# EAGLE design mini-48SE-0.7 (EAGLE 6.3)
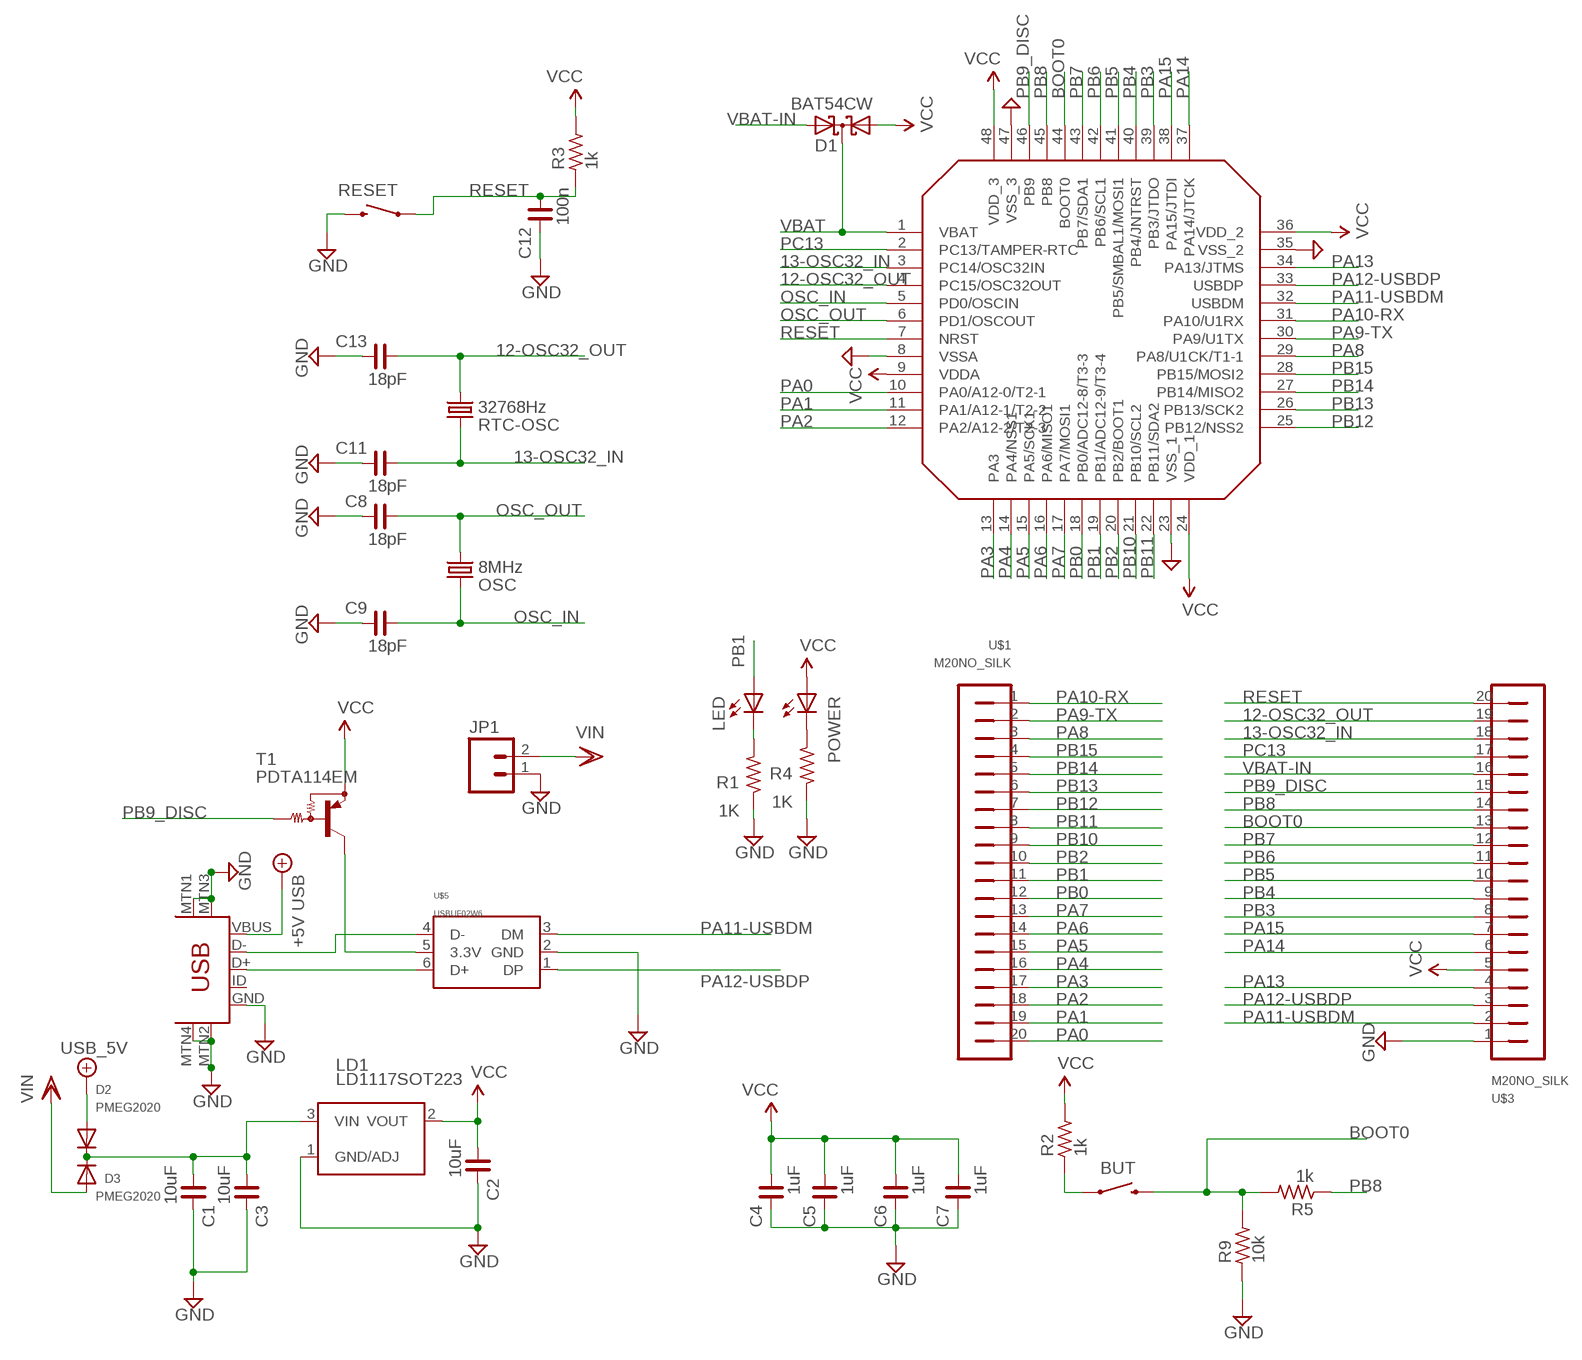
[diagram p0: schematic, sheet 1]

## Parts
BUT  SWITCH-MOMENTARY-2TS-1185  [TS1185]
C1  10uF  C_0603  [C0603]
C2  10uF  C_0805  [C0805]
C3  10uF  C_0603  [C0603]
C4  1uF  C_0603  [C0603]
C5  1uF  C_0603  [C0603]
C6  1uF  C_0603  [C0603]
C7  1uF  C_0603  [C0603]
C8  18pF  C_0603  [C0603]
C9  18pF  C_0603  [C0603]
C11  18pF  C_0603  [C0603]
C12  100n  C_0603  [C0603]
C13  18pF  C_0603  [C0603]
D1  BAT54CW  [SOT323R]
D2  PMEG2020  DIODESOD-323  [SOD-323]
D3  PMEG2020  DIODESOD-323  [SOD-323]
JP1  M02-JST-2MM-SMT  [JST-2-SMD]
LD1  LD1117SOT223  [SOT223]
LED  LED  LEDCHIPLED_1206  [CHIPLED_1206]
OSC  8MHz  CRYSTALTC26HM  [TC26H-M]
POWER  green  LEDCHIP-LED0603  [CHIP-LED0603]
R1  1K  R_0603  [R0603]
R2  1k  R_0603  [R0603]
R3  1k  R_0603  [R0603]
R4  1K  R_0603  [R0603]
R5  1k  R_0603  [R0603]
R9  10k  R_0603  [R0603]
RESET  SWITCH-MOMENTARY-2TS-1185  [TS1185]
RTC-OSC  32768Hz  CRYSTALTC26HM  [TC26H-M]
T1  PDTA114EM  PNP-DRIVERSOT323  [SOT323R]
U$1  M20NO_SILK  [1X20_NO_SILK]
U$3  M20NO_SILK  [1X20_NO_SILK]
U$4  STM32F103_48  [LQFP48-7X7]
U$5  USBUF02W6  [SC70-6]
USB  USB-MINIB-5PIN  [USB-MINIB]

## Nets
12-OSC32_OUT: C13.1 RTC-OSC.1 U$3.19 U$4.4(PC15/OSC32OUT)
13-OSC32_IN: C11.1 RTC-OSC.2 U$3.18 U$4.3(PC14/OSC32IN)
+5V/2 [vcc]: D2.A USB.VBUS ; supply symbol labelled USB_5V, +5V USB
BOOT0: BUT.2 R5.2 R9.2 U$3.13 U$4.44(BOOT0)
DGND: C1.2 C2.2 C3.2 C4.2 C5.2 C6.2 C7.2 C8.2 C9.2 C11.2 C12.2 C13.2 JP1.1 LD1.1(GND/ADJ) R1.1 R4.1 R9.1 RESET.2 U$3.1 U$4.8(VSSA) U$4.23(VSS_1) U$4.35(VSS_2) U$4.47(VSS_3) U$5.2(GND) USB.GND USB.MTN1(MTN2) USB.MTN2(MTN3) USB.MTN3(MTN1) USB.MTN4 ; supply symbol labelled GND
N$1: BUT.1 R2.1
N$2: LED.C R1.2
N$3: POWER.C R4.2
N$5 [vcc]: C1.1 C3.1 D2.C D3.C LD1.3(VIN)
N$6: T1.3(C) U$5.5(3.3V)
N$14: U$5.4(D-) USB.D-
N$17: U$5.6(D+) USB.D+
OSC_IN: C9.1 OSC.2 U$4.5(PD0/OSCIN)
OSC_OUT: C8.1 OSC.1 U$4.6(PD1/OSCOUT)
PA0: U$1.20 U$4.10(PA0/A12-0/T2-1)
PA1: U$1.19 U$4.11(PA1/A12-1/T2-2)
PA2: U$1.18 U$4.12(PA2/A12-2/T2-3)
PA3: U$1.17 U$4.13(PA3)
PA4: U$1.16 U$4.14(PA4/NSS1)
PA5: U$1.15 U$4.15(PA5/SCK1)
PA6: U$1.14 U$4.16(PA6/MISO1)
PA7: U$1.13 U$4.17(PA7/MOSI1)
PA8: U$1.3 U$4.29(PA8/U1CK/T1-1)
PA9-TX: U$1.2 U$4.30(PA9/U1TX)
PA10-RX: U$1.1 U$4.31(PA10/U1RX)
PA11-USBDM: U$3.2 U$4.32(USBDM) U$5.3(DM)
PA12-USBDP: U$3.3 U$4.33(USBDP) U$5.1(DP)
PA13: U$3.4 U$4.34(PA13/JTMS)
PA14: U$3.6 U$4.37(PA14/JTCK)
PA15: U$3.7 U$4.38(PA15/JTDI)
PB0: U$1.12 U$4.18(PB0/ADC12-8/T3-3)
PB1: LED.A U$1.11 U$4.19(PB1/ADC12-9/T3-4)
PB2: U$1.10 U$4.20(PB2/BOOT1)
PB3: U$3.8 U$4.39(PB3/JTDO)
PB4: U$3.9 U$4.40(PB4/JNTRST)
PB5: U$3.10 U$4.41(PB5/SMBAL1/MOSI1)
PB6: U$3.11 U$4.42(PB6/SCL1)
PB7: U$3.12 U$4.43(PB7/SDA1)
PB8: R5.1 U$3.14 U$4.45(PB8)
PB9_DISC: T1.1(B) U$3.15 U$4.46(PB9)
PB10: U$1.9 U$4.21(PB10/SCL2)
PB11: U$1.8 U$4.22(PB11/SDA2)
PB12: U$1.7 U$4.25(PB12/NSS2)
PB13: U$1.6 U$4.26(PB13/SCK2)
PB14: U$1.5 U$4.27(PB14/MISO2)
PB15: U$1.4 U$4.28(PB15/MOSI2)
PC13: U$3.17 U$4.2(PC13/TAMPER-RTC)
RESET: C12.1 R3.1 RESET.1 U$3.20 U$4.7(NRST)
VBAT: D1.3(CC) U$4.1(VBAT)
VBAT-IN: D1.2(A2) U$3.16
VCC [vcc]: C2.1 C4.1 C5.1 C6.1 C7.1 D1.1(A1) LD1.2(VOUT) POWER.A R2.2 R3.2 T1.2(E) U$3.5 U$4.9(VDDA) U$4.24(VDD_1) U$4.36(VDD_2) U$4.48(VDD_3)
VIN [vcc]: D3.A JP1.2
Unconnected: USB.ID

## Notes on the sheet
- BOOT0

## Library data of the parts
BUT RESET = es:SWITCH-MOMENTARY-2
C1-C9 C11-C13 = rc-master-smd:C_: NON-POLARIZED CAP
D1 = es:BAT54C: Schottky Diodes Source: Fairchild .. BAT54.pdf
D2 D3 = es:DIODE: Diode SMADIODE - SMA Surface Mount Package 20V 1A Schottky Diode Digikey: 641-1014-6-ND DO-1N4148 - Through Hole Small Current Diode SOD-123 20V 1 A (.5mV Vf) Schottky Diode - Digikey: MBRX120TPMSCT-ND SOD-323 10V 570mA (.38mV Vf, 3ns) Schottky Diode - Digikey: ZLLS410CT-ND SOD-523 30V 30mA Schottky Diode (RB751S-40TE61) - Digikey: RB751S-40TE61CT-ND SOT23-R/W - SOT23 Package (R = Solder Paste/Reflow Ovens, W = Hand-Soldering) BAT54Film 40V 300mA - Digikey: 497-7162-1-ND
JP1 = SparkFun_20110922_my:M02: Header 2 Standard 2-pin 0.1" header. Use with straight break away headers (SKU : PRT-00116), right angle break away headers (PRT-00553), swiss pins (PRT-00743), machine pins (PRT-00117), and female headers (PRT-00115). Molex polarized connector foot print use with SKU : PRT-08233 with associated crimp pins and housings.
LD1 = es:LD1117
LED POWER = led:LED: LED OSRAM: - CHIPLED LG R971, LG N971, LY N971, LG Q971, LY Q971, LO R971, LY R971 LH N974, LH R974 LS Q976, LO Q976, LY Q976 LO Q996 - Hyper CHIPLED LW Q18S LB Q993, LB Q99A, LB R99A - SideLED LS A670, LO A670, LY A670, LG A670, LP A670 LB A673, LV A673, LT A673, LW A673 LH A674 LY A675 LS A676, LA A676, LO A676, LY A676, LW A676 LS A679, LY A679, LG A679 - Hyper Micro SIDELED® LS Y876, LA Y876, LO Y876, LY Y876 LT Y87S - SmartLED LW L88C, LW L88S LB L89C, LB L89S, LG L890 LS L89K, LO L89K, LY L89K LS L896, LA L896, LO L896, LY L896 - TOPLED LS T670, LO T670, LY T670, LG T670, LP T670 LSG T670, LSP T670, LSY T670, LOP T670, LYG T670 LG T671, LOG T671, LSG T671 LB T673, LV T673, LT T673, LW T673 LH T674 LS T676, LA T676, LO T676, LY T676, LB T676, LH T676, LSB T676, LW T676 LB T67C, LV T67C, LT T67C, LS T67K, LO T67K, LY T67K, LW E67C LS E67B, LA E67B, LO E67B, LY E67B, LB E67C, LV E67C, LT E67C LW T67C LS T679, LY T679, LG T679 LS T770, LO T770, LY T770, LG T770, LP T770 LB T773, LV T773, LT T773, LW T773 LH T774 LS E675, LA E675, LY E675, LS T675 LS T776, LA T776, LO T776, LY T776, LB T776 LHGB T686 LT T68C, LB T68C - Hyper Mini TOPLED® LB M676 - Mini TOPLED Santana® LG M470 LS M47K, LO M47K, LY M47K Source: http://www.osram.convergy.de LUXEON: - LUMILED® LXK2-PW12-R00, LXK2-PW12-S00, LXK2-PW14-U00, LXK2-PW14-V00 LXK2-PM12-R00, LXK2-PM12-S00, LXK2-PM14-U00 LXK2-PE12-Q00, LXK2-PE12-R00, LXK2-PE12-S00, LXK2-PE14-T00, LXK2-PE14-U00 LXK2-PB12-K00, LXK2-PB12-L00, LXK2-PB12-M00, LXK2-PB14-N00, LXK2-PB14-P00, LXK2-PB14-Q00 LXK2-PR12-L00, LXK2-PR12-M00, LXK2-PR14-Q00, LXK2-PR14-R00 LXK2-PD12-Q00, LXK2-PD12-R00, LXK2-PD12-S00 LXK2-PH12-R00, LXK2-PH12-S00 LXK2-PL12-P00, LXK2-PL12-Q00, LXK2-PL12-R00 Source: www.luxeon.com KINGBRIGHT: KA-3528ASYC Source: www.kingbright.com
OSC RTC-OSC = SparkFun_20110922_my:CRYSTAL: Crystals Various standard crystals. Proven footprints. Spark Fun Electronics SKU : COM-00534
R1-R5 R9 = rc-master-smd:R_: RESISTOR
T1 = es:PNP-DRIVER
U$1 U$3 = es:M20
U$4 = stm32_a:STM32F103_48
U$5 = es:USBUF
USB = SparkFun_20110922_my:USB-MINIB: Mini-USB "B" connector with 5th pin broken out. Created new symbol breaking out 5th "ID" pin in mini/micro USB connector spec. See: http://en.wikipedia.org/wiki/Mini_usb#Cables. Uses same footprint as 4-pin symbol. Also added pins to connect to mounting / shield pads if required (probably not generally needed as signals aren't shielded once they leave the connector).

## Net classes
1 vcc: width 0.25 mm

## Board
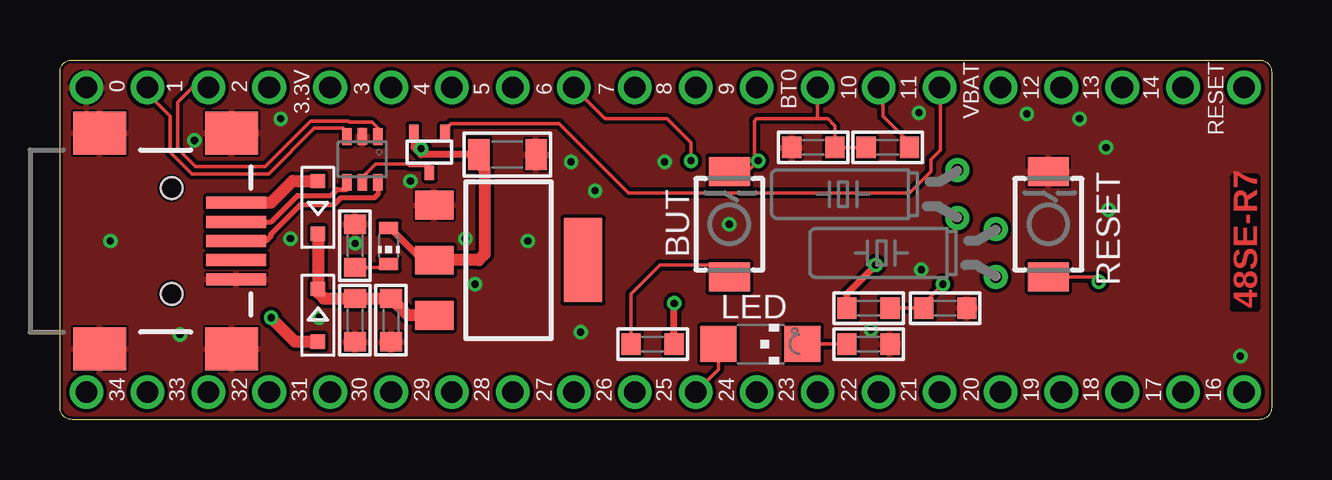
[diagram p1: board, top side]
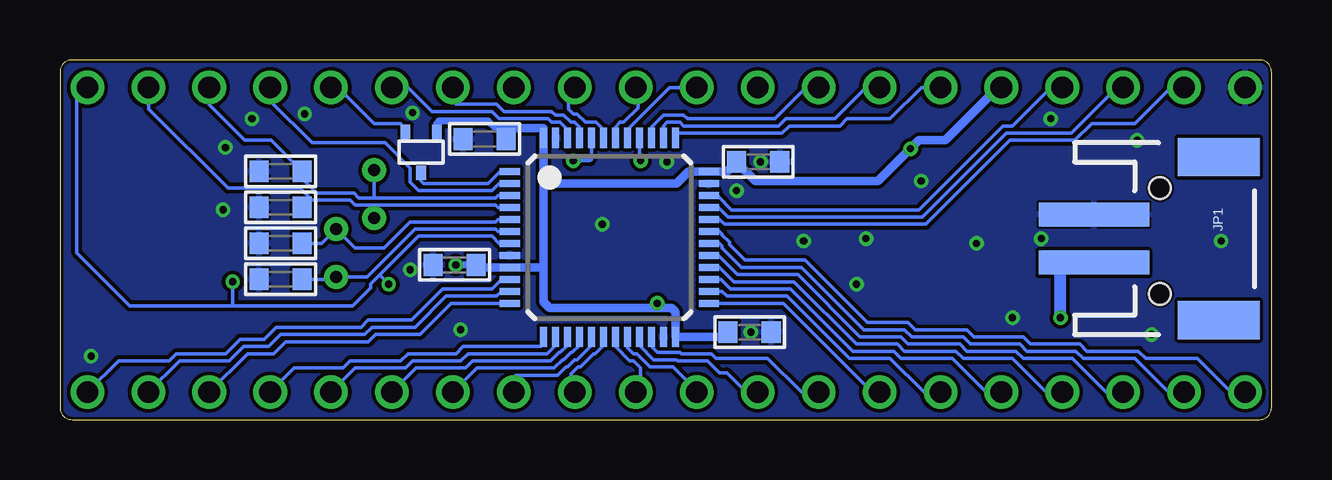
[diagram p2: board, bottom side, seen from below]

Size 50.5 x 15 mm. Coordinates in mm from the lower left corner, seen from the top.
Outline: 0.5,15 50,15 arc-90 50.5,14.5 50.5,0.5 arc-90 50,0 0.5,0 arc-90 0,0.5 0,14.5 arc-90 0.5,15
Copper layers (1*16): Top 0.018mm / dielectric 1.5mm / Bottom 0.018mm
Design rules "default *": minimum track width 0.15mm, minimum drill 0.3mm, track to track 0.15mm, track to pad 0.15mm, pad to pad 0.15mm, via to via 0.15mm, smd to smd 0.15mm, copper to edge 0.12mm, drill to drill 0.15mm, minimum pad ring 0.25mm, minimum via ring 0.15mm, stop-mask expansion 0mil, vias tented up to drill 0.5mm, thermal gap 0.09mm

### Footprints (pad centres in the part's own frame; a part is rotated, then mirrored left to right if it is on the bottom)
TS1185 = smd 1.2 x 1.7: 1 -2.2,0; 2 2.2,0
C0603 = smd 0.8 x 0.9: 1 -0.9,0; 2 0.9,0
C0805 = smd 0.9 x 1.3: 1 -1.2,0; 2 1.2,0
SOT323R = smd 0.4 x 0.6: 1 -0.65,-0.85; 2 0.65,-0.85; 3 0,0.85
SOD-323 = smd 0.6 x 0.6: A 1.1,0; C -1.1,0
JST-2-SMD = smd 1 x 4.6: 1 -1,-3.7; 2 1,-3.7 | smd 1.6 x 3.4: NC1 -3.4,1.5; NC2 3.4,1.5
SOT223 = smd 1.2 x 1.6: 1 -2.3,-3.1; 2 0,-3.1; 3 2.3,-3.1 | smd 3.5 x 1.6: 4 0,3.1
CHIPLED_1206 = smd 1.5 x 1.5: A 0,-1.75; C 0,1.75
TC26H-M = drill 0.5: 1 -1,0; 2 1,0
CHIP-LED0603 = smd 0.8 x 0.5: A 0,-0.75; C 0,0.75
R0603 = smd 0.8 x 0.9: 1 -0.9,0; 2 0.9,0
1X20_NO_SILK = drill 0.9: 1 0,0; 2 2.54,0; 3 5.08,0; 4 7.62,0; 5 10.16,0; 6 12.7,0; 7 15.24,0; 8 17.78,0; 9 20.32,0; 10 22.86,0; 11 25.4,0; 12 27.94,0; 13 30.48,0; 14 33.02,0; 15 35.56,0; 16 38.1,0; 17 40.64,0; 18 43.18,0; 19 45.72,0; 20 48.26,0
LQFP48-7X7 = smd 0.85 x 0.3: 1 -4.15,2.75; 2 -4.15,2.25; 3 -4.15,1.75; 4 -4.15,1.25; 5 -4.15,0.75; 6 -4.15,0.25; 7 -4.15,-0.25; 8 -4.15,-0.75; 9 -4.15,-1.25; 10 -4.15,-1.75; 11 -4.15,-2.25; 12 -4.15,-2.75; 25 4.15,-2.75; 26 4.15,-2.25; 27 4.15,-1.75; 28 4.15,-1.25; 29 4.15,-0.75; 30 4.15,-0.25; 31 4.15,0.25; 32 4.15,0.75; 33 4.15,1.25; 34 4.15,1.75; 35 4.15,2.25; 36 4.15,2.75 | smd 0.3 x 0.85: 13 -2.75,-4.15; 14 -2.25,-4.15; 15 -1.75,-4.15; 16 -1.25,-4.15; 17 -0.75,-4.15; 18 -0.25,-4.15; 19 0.25,-4.15; 20 0.75,-4.15; 21 1.25,-4.15; 22 1.75,-4.15; 23 2.25,-4.15; 24 2.75,-4.15; 37 2.75,4.15; 38 2.25,4.15; 39 1.75,4.15; 40 1.25,4.15; 41 0.75,4.15; 42 0.25,4.15; 43 -0.25,4.15; 44 -0.75,4.15; 45 -1.25,4.15; 46 -1.75,4.15; 47 -2.25,4.15; 48 -2.75,4.15
SC70-6 = smd 0.4 x 0.7: 1 -0.65,-0.95; 2 0,-0.95; 3 0.65,-0.95; 4 0.65,0.95; 5 0,0.95; 6 -0.65,0.95
USB-MINIB = smd 2.5 x 0.5: D+ 2.7,0; D- 2.7,0.8; GND 2.7,-1.6; ID 2.7,-0.8; VBUS 2.7,1.6 | smd 2.2 x 1.8: MTN1 -3,4.5; MTN2 2.5,4.5; MTN3 -3,-4.5; MTN4 2.5,-4.5 | hole 0.9: 0,2.2; 0,-2.2

### Placement (x,y rotation side)
BUT  27.9,8.15 90 top
C1  13.8,4.15 270 top
C2  18.65,11.05 0 top
C3  12.3,4.15 270 top
C4  34.05,6.45 180 bottom
C5  21.4,10.75 0 bottom
C6  21.75,3.65 0 bottom
C7  32.8,11.7 180 bottom
C8  41.3,5.85 180 bottom
C9  41.3,7.35 180 bottom
C11  41.3,10.35 180 bottom
C12  36.9,4.65 0 top
C13  41.3,8.85 180 bottom
D1  35.45,11.15 180 bottom
D2  10.75,8.85 90 top
D3  10.75,4.35 270 top
JP1  3.7,7.55 270 bottom
LD1  18.7,6.65 270 top
LED  29.2,3.15 270 top
OSC  39,6.95 90 top
POWER  13.7,7.25 180 top
R1  33.7,3.15 180 top
R2  24.7,3.15 0 top
R3  33.7,4.65 180 top
R4  12.3,7.25 270 top
R5  34.5,11.35 180 top
R9  31.4,11.35 0 top
RESET  41.2,8.15 90 top
RTC-OSC  37.4,9.4 90 top
T1  15.4,11.15 180 top
U$1  1.1,1.15 180 bottom
U$3  1.1,13.85 180 bottom
U$4  27.6,7.6 0 bottom
U$5  12.6,10.85 180 top
USB  4.65,7.45 0 top

### Tracks (layer width: path | path; a pad name or v marks a point on that pad's centre or on a via)
12-OSC32_OUT
  Bottom 0.15: U$4.4 32.25,8.85 32.35,8.95 37.4,8.95 | 37.4,8.95 38.2,8.95 38.4,9.15 40,9.15 | RTC-OSC.1 37.4,8.95 | 40,9.15 40.5,9.65 43.5,9.65 46.8,12.95 46.8,13.83 U$3.19 | 40,9.15 40.1,9.15 C13.1
13-OSC32_IN
  Bottom 0.15: U$4.3 32.25,9.35 32.35,9.25 37.4,9.25 | 37.4,9.25 38.05,9.25 38.25,9.45 39.8,9.45 40.4,10.05 C11.1 41.7,11.65 42.8,11.65 44.28,13.13 U$3.18 | 37.4,9.25 RTC-OSC.2
+5V/2
  Top 0.5: USB.VBUS 8.8,9.05 9.7,9.95 D2.A
BOOT0  (via drill 0.3)
  Top 0.15: R5.2 R9.2 32.3,12.25 32,12.55 31.5,12.55 | 31.5,12.55 29.04,12.55 28.94,12.45 28.94,10.96 v29.1,10.8 28.65,10.35 BUT.2 | U$3.13 31.58,12.63 31.5,12.55
  Bottom 0.15: U$4.44 28.35,10.85 28.4,10.8 v29.1,10.8
DGND  (via drill 0.3)
  other vias: 2.1,7.45 9.6,7.55 9.2,12.55 5.6,11.65 14.6,9.95 17.3,5.65 19.5,7.45 21.3,10.75 22.3,9.55 27.9,8.15 25.2,10.75 21.7,3.65 33.8,3.75 35.9,6.25 43.7,8.75 43.6,11.35 42.5,12.55 40.3,12.75 49.2,2.65 10.8,4.25 12.3,7.35 16.9,7.55 5,3.55 35.8,12.8
  pour Bottom: 0,0 0,15 50.5,15 50.5,0
  pour Top: 0,0 0,15 50.5,15 50.5,0
N$1
  Top 0.15: R2.1 23.8,5.25 25,6.45 27.4,6.45 BUT.1
N$2
  Top 0.15: LED.C R1.2
N$3
  Top 0.15: R4.2 13.55,6.35 POWER.C
N$5
  Top 0.5: D2.C D3.C 10.75,5.3 11,5.05 C3.1 C1.1 14.5,4.35 LD1.3
N$6
  Top 0.15: U$5.5 12.6,10.1 13.15,10.65 14.5,10.65 14.55,10.6 15.35,10.6 15.4,10.55 T1.3 15.35,10.25
N$14
  Top 0.2: USB.D- 8.8,8.25 9.9,9.35 11.3,9.35 11.55,9.6 11.95,9.6 U$5.4
N$17
  Top 0.2: U$5.6 13.25,9.4 13.1,9.25 11.7,9.25 11.4,8.95 10,8.95 8.8,7.75 8.8,7.65 8.6,7.45 USB.D+
OSC_IN
  Bottom 0.15: U$4.5 32.25,8.35 32.35,8.25 35.9,8.25 37,7.15 38.2,7.15 OSC.2 39.6,7.35 C9.1
OSC_OUT
  Bottom 0.15: U$4.6 32.25,7.85 32.35,7.95 35.7,7.95 37.7,5.95 OSC.1 39.1,5.85 C8.1
PA0
  Bottom 0.15: U$4.10 32.1,5.85 32.5,5.45 34.55,5.45 35.85,4.15 37.65,4.15 37.95,3.85 41.5,3.85 42,3.35 43,3.35 43.6,2.75 45.65,2.75 45.95,2.45 48.06,2.45 U$1.20
PA1
  Bottom 0.15: U$4.11 32.1,5.35 32.3,5.15 34.4,5.15 35.7,3.85 37.5,3.85 37.8,3.55 41.3,3.55 41.8,3.05 42.85,3.05 43.45,2.45 45.52,2.45 U$1.19
PA2
  Bottom 0.15: U$4.12 34.2,4.85 35.5,3.55 37.35,3.55 37.65,3.25 41.1,3.25 41.6,2.75 42.68,2.75 U$1.18
PA3
  Bottom 0.15: U$4.13 30.35,3.15 30.45,3.05 33.7,3.05 34,2.75 36,2.75 36.3,2.45 38.4,2.45 38.7,2.15 40.74,2.15 U$1.17
PA4
  Bottom 0.15: U$4.14 29.85,3.1 30.2,2.75 33.5,2.75 33.8,2.45 35.8,2.45 36.1,2.15 38.2,2.15 U$1.16
PA5
  Bottom 0.15: U$4.15 29.35,3.1 29.65,2.8 29.7,2.8 30.05,2.45 33.3,2.45 33.6,2.15 35.66,2.15 U$1.15
PA6
  Bottom 0.15: U$4.16 28.85,3.1 29.15,2.8 29.2,2.8 29.5,2.5 29.55,2.5 29.9,2.15 33.12,2.15 U$1.14
PA7
  Bottom 0.15: U$4.17 28.35,3.1 28.95,2.5 29.05,2.5 29.35,2.2 29.4,2.2 29.75,1.85 31.5,1.85 31.6,1.75 31.6,1.17 U$1.13
PA8
  Bottom 0.15: U$4.29 23.05,6.85 22.25,6.05 19.75,6.05 17.15,3.45 15.45,3.45 15.15,3.15 13,3.15 12.7,2.85 10.65,2.85 10.35,2.55 8.3,2.55 6.9,1.15 U$1.3
PA9-TX
  Bottom 0.15: U$4.30 23,7.35 22.9,7.25 22.9,7.15 22.1,6.35 19.6,6.35 17,3.75 15.3,3.75 15,3.45 12.85,3.45 12.55,3.15 10.5,3.15 10.2,2.85 8.15,2.85 7.85,2.55 5.7,2.55 4.3,1.15 U$1.2
PA10-RX
  Bottom 0.15: U$4.31 23,7.85 22.9,7.75 22.9,7.7 22.6,7.4 22.6,7.3 21.95,6.65 19.45,6.65 16.85,4.05 15.15,4.05 14.85,3.75 12.7,3.75 12.4,3.45 10.35,3.45 10.05,3.15 8,3.15 7.7,2.85 5.55,2.85 5.25,2.55 3.1,2.55 1.7,1.15 U$1.1
PA11-USBDM
  Top 0.15: U$5.3 11.95,12 11.8,12.15 10.6,12.15 8.7,10.25 5.5,10.25 4.6,11.15 4.6,12.65 3.6,13.65 3.6,13.81 U$3.2
  Bottom 0.15: U$4.32 23,8.35 22.8,8.15 14.4,8.15 10.9,11.65 8.2,11.65 7.5,12.35 5.7,12.35 4.2,13.85 U$3.2
PA12-USBDP
  Top 0.15: U$5.1 13.25,12.15 13,12.4 12.05,12.4 12,12.45 10.45,12.45 8.55,10.55 5.65,10.55 4.9,11.3 4.9,13.25 5.5,13.85 U$3.3
  Bottom 0.15: U$4.33 23.05,8.85 22.65,8.45 14.55,8.45 11.05,11.95 8.35,11.95 6.45,13.85 U$3.3
PA13
  Bottom 0.15: U$4.34 23.1,9.35 22.5,8.75 14.7,8.75 11.2,12.25 10.8,12.25 9.2,13.85 U$3.4
PA14
  Bottom 0.15: U$4.37 24.85,11.9 24.8,11.95 20.4,11.95 20.1,12.25 18,12.25 17.7,12.55 15.9,12.55 14.6,13.85 U$3.6
PA15
  Bottom 0.15: U$4.38 25.35,12.25 25.2,12.4 24.65,12.4 24.5,12.25 20.55,12.25 20.25,12.55 18.2,12.55 16.9,13.85 U$3.7
PB0
  Bottom 0.15: U$4.18 27.85,3.1 28.2,2.75 28.25,2.75 28.8,2.2 28.9,2.2 29.2,1.9 29.2,1.31 U$1.12
PB1
  Top 0.15: LED.A 27.45,2.1 U$1.11
  Bottom 0.15: U$4.19 27.35,3.05 26.75,2.45 26.6,2.45 26.3,2.15 26.3,1.15 U$1.11
PB2
  Bottom 0.15: U$4.20 26.85,3 26.6,2.75 26.45,2.75 25.9,2.2 24.95,2.2 23.9,1.15 U$1.10
PB3
  Bottom 0.15: U$4.39 25.85,12.2 25.35,12.7 24.5,12.7 24.35,12.55 20.7,12.55 19.4,13.85 U$3.8
PB4  (via drill 0.3)
  Top 0.15: v26.3,10.8 26.3,11.55 25.3,12.55 22.72,12.55 U$3.9
  Bottom 0.15: U$4.40 26.35,10.85 v26.3,10.8
PB5
  Bottom 0.15: U$4.41 26.85,12.1 25.1,13.85 U$3.10
PB6
  Bottom 0.15: U$4.42 27.35,12.2 27.15,12.4 27,12.4 26.4,13 26.4,13.75 U$3.11
PB7
  Bottom 0.15: U$4.43 27.85,12.1 28.15,12.4 28.6,12.4 28.94,12.74 29.09,12.74 29.3,12.95 29.3,13.59 U$3.12
PB8
  Top 0.15: R5.1 35.4,11.55 34.3,12.65 34.3,13.67 U$3.14
  Bottom 0.15: U$4.45 28.85,12.2 29.05,12.4 29.2,12.4 29.5,12.7 29.85,12.7 30,12.85 32,12.85 32.3,13.15 34,13.15 34.1,13.25 34.1,13.85 U$3.14
PB9_DISC
  Top 0.15: T1.1 16.05,12.1 16.3,12.35 20.8,12.35 23.7,9.45 35.4,9.45 36.3,10.35 36.3,10.85 36.7,11.25 36.7,13.81 U$3.15
  Bottom 0.15: U$4.46 29.35,12.1 29.65,12.4 30,12.4 30.15,12.55 32.2,12.55 32.5,12.85 35,12.85 36,13.85 U$3.15
PB10
  Bottom 0.15: U$4.21 26.35,3.1 25.75,2.5 24.8,2.5 24.75,2.45 23.5,2.45 23,1.95 22.7,1.95 21.9,1.15 U$1.9
PB11
  Bottom 0.15: U$4.22 25.85,3.05 25.6,2.8 24.65,2.8 24.6,2.75 23.35,2.75 23.15,2.55 21,2.55 19.6,1.15 U$1.8
PB12
  Bottom 0.15: U$4.25 20.35,4.85 16.65,1.15 U$1.7
PB13
  Bottom 0.15: U$4.26 22.9,5.35 22.7,5.15 20.2,5.15 17.6,2.55 15.9,2.55 14.5,1.15 U$1.6
PB14
  Bottom 0.15: U$4.27 22.95,5.85 22.55,5.45 20.05,5.45 17.45,2.85 15.75,2.85 15.45,2.55 13.3,2.55 11.9,1.15 U$1.5
PB15
  Bottom 0.15: U$4.28 23,6.35 22.4,5.75 19.9,5.75 17.3,3.15 15.6,3.15 15.3,2.85 13.15,2.85 12.85,2.55 10.8,2.55 9.4,1.15 U$1.4
PC13
  Bottom 0.15: U$4.2 32.2,9.85 32.5,9.55 35.55,9.55 35.9,9.9 35.9,10.5 36.95,11.55 40,11.55 41.7,13.25 41.7,13.81 U$3.17
RESET  (via drill 0.3)
  Top 0.15: 49.1,13.59 U$3.20 | R3.1 C12.1 36,4.85 v36.8,5.65 | RESET.1 43.1,5.95 v43.3,5.75
  Bottom 0.15: U$4.7 32.2,7.35 32.5,7.65 35.55,7.65 37.18,6.03 | 37.18,6.03 37.55,5.65 37.55,5.5 38.3,4.75 43.3,4.75 | 43.3,4.75 47.6,4.75 49.8,6.95 49.8,13.41 U$3.20 | v36.8,5.65 37.18,6.03 | v43.3,5.75 43.3,4.75
VBAT
  Bottom 0.15: U$4.1 32.15,10.35 32.65,9.85 35.35,9.85 35.45,9.95 D1.3
VBAT-IN
  Bottom 0.15: D1.2 36.1,12.15 36.3,12.35 37.4,12.35 38.9,13.85 U$3.16
VCC  (via drill 0.3)
  Top 0.3: T1.2 14.75,11.35 14.82,11.27 | C2.1 15.05,11.05 14.82,11.27 | POWER.A 13.75,8 15.1,6.65 LD1.2 | v15.05,11.3 14.85,11.3 14.82,11.27 | R3.2 32.8,5.25 v34,6.45 | R2.2 v25.6,4.85
  Top 0.5: C2.1 17.45,10.7 17.7,10.45 17.7,6.9 17.45,6.65 LD1.2
  Bottom 0.3: 32.05,12.15 32.35,12.15 32.65,12.45 34.7,12.45 34.8,12.35 D1.1 | v25.6,4.85 25.6,4.65 | C4.1 v34,6.45
  Bottom 0.35: 31.9,12.15 30.35,12.15 U$4.48 30.35,9.85 | 31.9,12.15 32.05,12.15 | C4.1 33,6.45 32.9,6.35 U$4.9 30.35,6.35 | C6.1 22.85,3.45 U$4.24 24.85,4.5 25,4.65 25.6,4.65 30.1,4.65 30.35,4.9 30.35,6.35 | 30.35,9.85 24.8,9.85 24.3,10.35 U$4.36 22.7,10.35 C5.1 21.5,9.95 16.4,9.95 v15.05,11.3 14.7,11.65 13.6,11.65 11.4,13.85 U$3.5 | 30.35,9.85 30.35,6.35 | C7.1 31.9,12.15
VIN  (via drill 0.3)
  Top 0.5: D3.A 9.8,3.25 v8.8,4.25
  Bottom 0.5: v8.8,4.25 8.8,6.35 8.6,6.55 JP1.2

### Text on the board
Top: 48SE-R7
tNames: 0 | 1 | 2 | 3 | 4 | 5 | 6 | 7 | 8 | 9 | 3.3V | BT0 | 10 | 11 | VBAT | 12 | 13 | 14 | RESET | 34 | 33 | 32 | 31 | 30 | 29 | 28 | 27 | 26 | 25 | 24 | 23 | 22 | 21 | 20 | 19 | 18 | 17 | 16